# EAGLE design mps340g + mbi270 (1) (EAGLE 9.5.1)
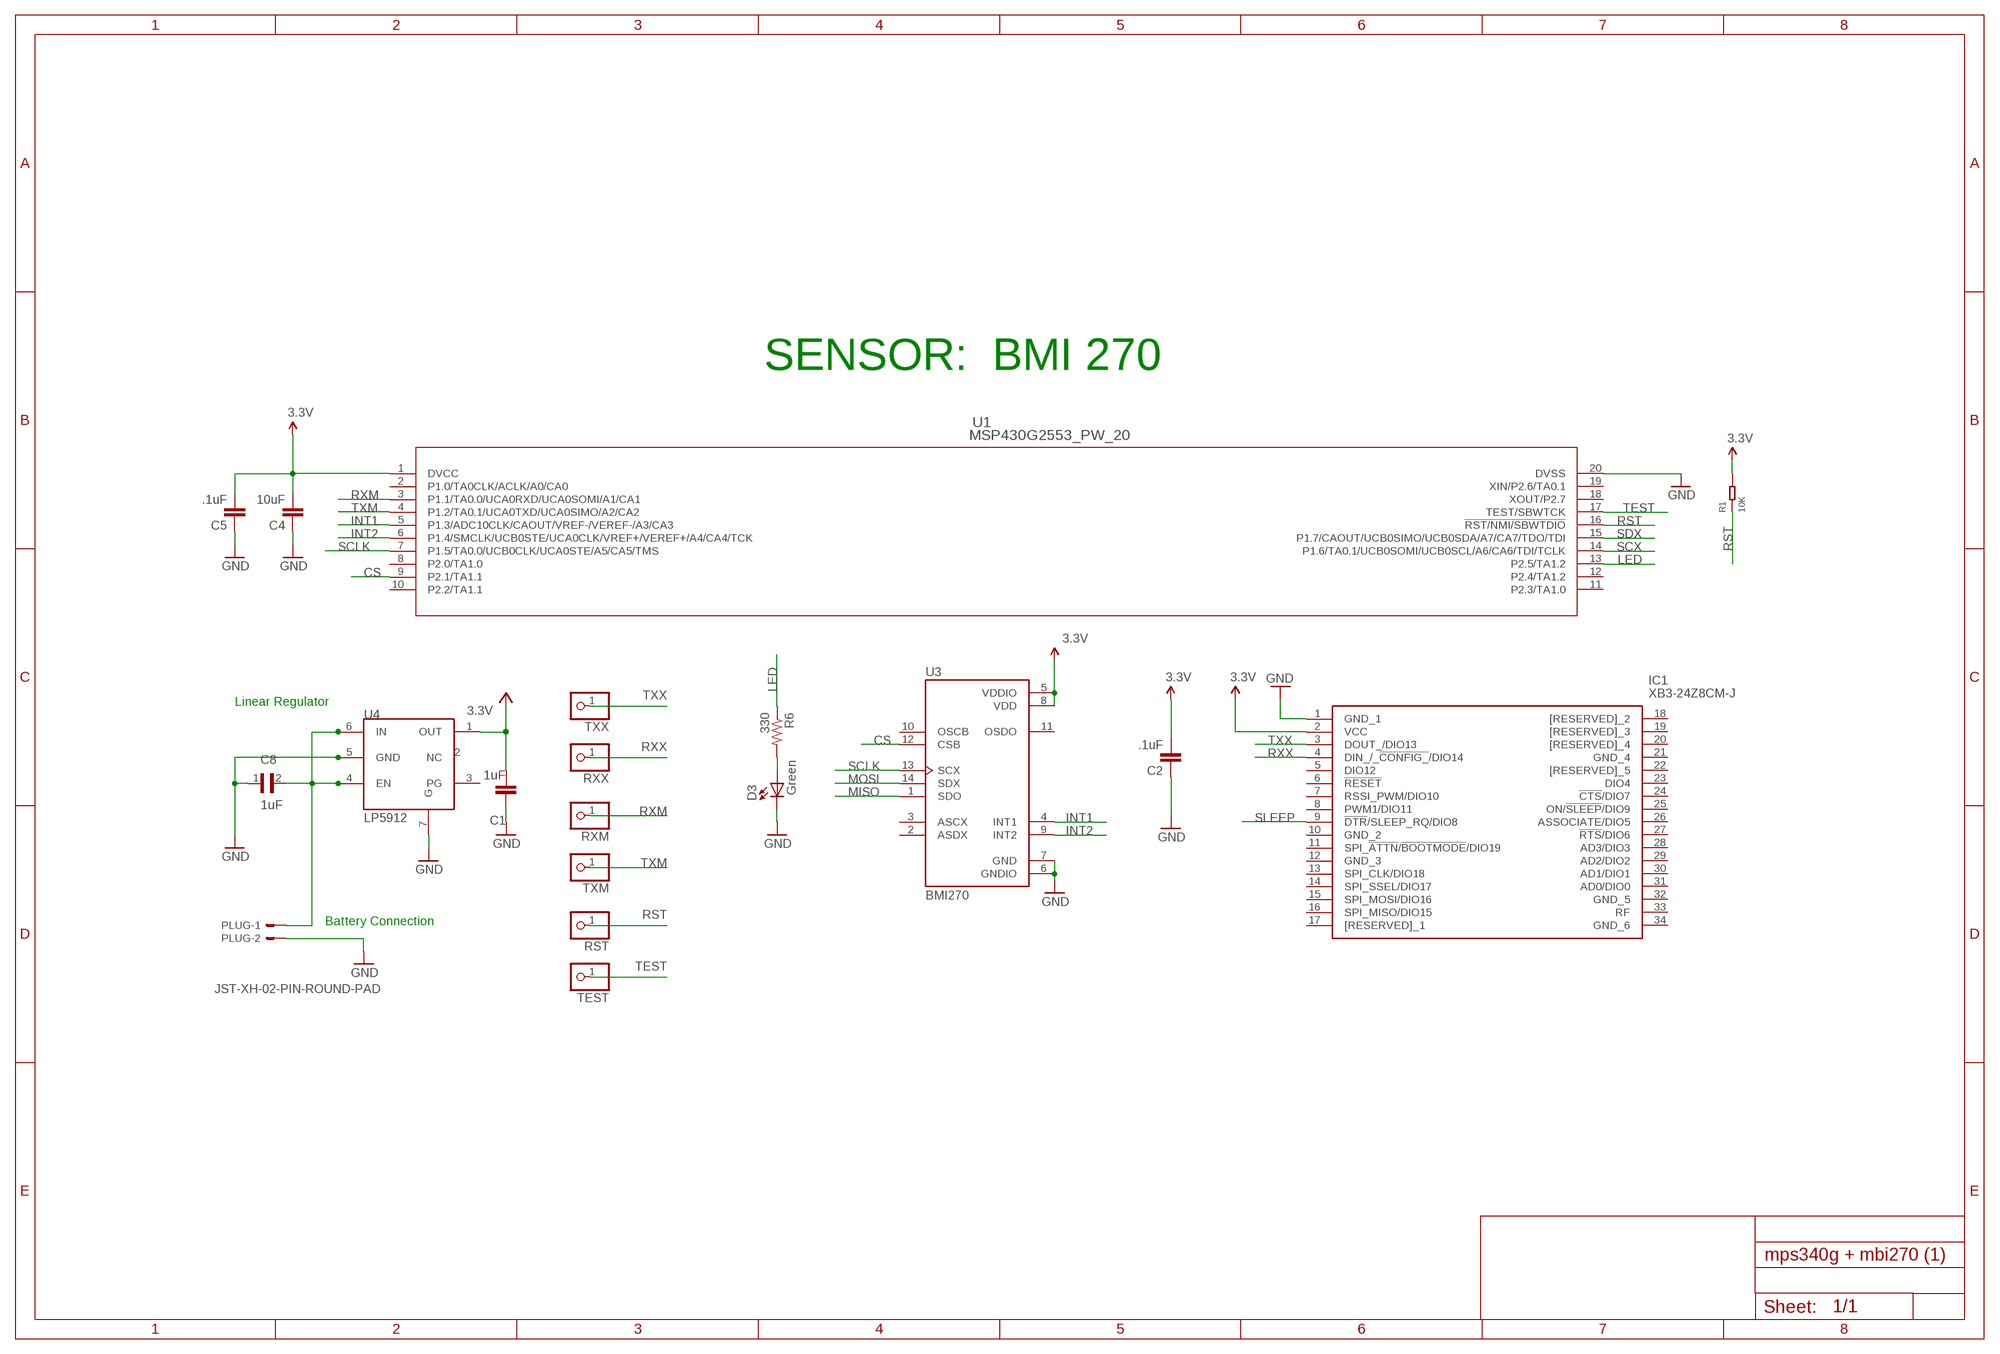
[diagram p0: schematic, sheet 1]

## Parts
C1  1uF  C-EUC0603  [C0603]
C2  .1uF  0.1UF-25V(+80/-20%)(0603)  [0603-CAP]
C4  10uF  0.1UF-25V(+80/-20%)(0603)  [0603-CAP]
C5  .1uF  0.1UF-25V(+80/-20%)(0603)  [0603-CAP]
C8  1uF  0402YD105MAT2A  [CAPC1005X71N]
D3  Green  LED  [0603-LED-ALT1]
IC1  XB3-24Z8CM-J  [XB324Z8CMJ]
PLUG  JST-XH-02-PIN-ROUND-PAD  [JST-XH-02-PACKAGE-ROUND-PAD]
R1  10K  SMD-RES-4.7K-5%-1/16W(0402)  [R0402]
R6  330  RESISTOR0603-RES  [0603-RES]
RST  PINHD-1X1  [1X01]
RXM  PINHD-1X1  [1X01]
RXX  PINHD-1X1  [1X01]
TEST  PINHD-1X1  [1X01]
TXM  PINHD-1X1  [1X01]
TXX  PINHD-1X1  [1X01]
U1  MSP430G2553_PW_20  [PW20]
U3  BMI270  [XDCR_BMI270]
U4  LP5912  [LP5912]

## Nets
3.3V: C2.2 C4.2 C5.2 IC1.2(VCC) R1.2 U1.1(DVCC) U3.5(VDDIO) U3.8(VDD)
BATTERY: C8.2 PLUG.1 U4.4(EN) U4.6(IN)
CS: U1.9(P2.1/TA1.1) U3.12(CSB)
GND [vcc]: C1.1 C2.1 C4.1 C5.1 C8.1 D3.C IC1.1(GND_1) PLUG.2 U1.20(DVSS) U3.6(GNDIO) U3.7(GND) U4.5(GND) U4.7(G)
INT1: U1.5(P1.3/ADC10CLK/CAOUT/VREF-/VEREF-/A3/CA3) U3.4(INT1)
INT2: U1.6(P1.4/SMCLK/UCB0STE/UCA0CLK/VREF+/VEREF+/A4/CA4/TCK) U3.9(INT2)
LED: R6.1 U1.13(P2.5/TA1.2)
MISO: U3.1(SDO)
MOSI: U3.14(SDX)
N$7: D3.A R6.2
RST: R1.1 RST.1 U1.16(!RST/NMI/SBWTDIO)
RXM: RXM.1 U1.3(P1.1/TA0.0/UCA0RXD/UCA0SOMI/A1/CA1)
RXX: IC1.4(DIN_/_!CONFIG_!/DIO14) RXX.1
SCLK: U1.7(P1.5/TA0.0/UCB0CLK/UCA0STE/A5/CA5/TMS) U3.13(SCX)
SCX: U1.14(P1.6/TA0.1/UCB0SOMI/UCB0SCL/A6/CA6/TDI/TCLK)
SDX: U1.15(P1.7/CAOUT/UCB0SIMO/UCB0SDA/A7/CA7/TDO/TDI)
SLEEP: IC1.9(!DTR!/SLEEP_RQ/DIO8)
TEST: TEST.1 U1.17(TEST/SBWTCK)
TXM: TXM.1 U1.4(P1.2/TA0.1/UCA0TXD/UCA0SIMO/A2/CA2)
TXX: IC1.3(DOUT_/DIO13) TXX.1
VCC: C1.2 U4.1(OUT) ; supply symbol labelled 3.3V
Unconnected: IC1.5(DIO12) IC1.6(!RESET) IC1.7(RSSI_PWM/DIO10) IC1.8(PWM1/DIO11) IC1.10(GND_2) IC1.11(SPI_!ATTN!/!BOOTMODE!/DIO19) IC1.12(GND_3) IC1.13(SPI_CLK/DIO18) IC1.14(SPI_SSEL/DIO17) IC1.15(SPI_MOSI/DIO16) IC1.16(SPI_MISO/DIO15) IC1.17([RESERVED]_1) IC1.18([RESERVED]_2) IC1.19([RESERVED]_3) IC1.20([RESERVED]_4) IC1.21(GND_4) IC1.22([RESERVED]_5) IC1.23(DIO4) IC1.24(!CTS!/DIO7) IC1.25(ON/!SLEEP!/DIO9) IC1.26(ASSOCIATE/DIO5) IC1.27(!RTS!/DIO6) IC1.28(AD3/DIO3) IC1.29(AD2/DIO2) IC1.30(AD1/DIO1) IC1.31(AD0/DIO0) IC1.32(GND_5) IC1.33(RF) IC1.34(GND_6) U1.2(P1.0/TA0CLK/ACLK/A0/CA0) U1.8(P2.0/TA1.0) U1.10(P2.2/TA1.1) U1.11(P2.3/TA1.0) U1.12(P2.4/TA1.2) U1.18(XOUT/P2.7) U1.19(XIN/P2.6/TA0.1) U3.2(ASDX) U3.3(ASCX) U3.10(OSCB) U3.11(OSDO) U4.2(NC) U4.3(PG)

## Notes on the sheet
- SENSOR:  BMI 270
- Linear Regulator
- Battery Connection

## Library data of the parts
C1 = rcl:C-EU: CAPACITOR, European symbol; SPICEPREFIX: C
C2 C4 C5 = SparkFun-Capacitors:0.1UF-25V(+80/-20%)(0603): CAP-00810 Ceramic Standard decoupling cap; PROD_ID: CAP-00810; VALUE: 0.1uF
C8 = Capacitor1uF:0402YD105MAT2A: CAP 1UF 16VDC X5R 20% SMD 0402; AVAILABILITY: Unavailable; DESCRIPTION: Cap 1uf 16vdc X5r 20% Smd 0402; MF: AVX; MP: 0402YD105MAT2A; PACKAGE: 1005 AVX; PRICE: None
D3 = Testing:LED: LEDs Standard schematic elements and footprints for 5mm, 3mm, 1206, and 0603 sized LEDs. 5mm - Spark Fun Electronics SKU : COM-00529 (and others)
IC1 = XB3-24Z8CM-J:XB3-24Z8CM-J: Zigbee Modules (802.15.4) XBee3 ,2.4 Ghz ZB 3.0, Chip Ant, MMT Source: Datasheet <https://www.digi.com/resources/documentation/digidocs/pdfs/90001543.pdf>; DESCRIPTION: Zigbee Modules (802.15.4) XBee3 ,2.4 Ghz ZB 3.0, Chip Ant, MMT; HEIGHT: 4mm; MANUFACTURER_NAME: Digi International; MANUFACTURER_PART_NUMBER: XB3-24Z8CM-J; MOUSER_PART_NUMBER: 888-XB3-24Z8CM-J; MOUSER_PRICE-STOCK: https://www.mouser.com/Search/Refine.aspx?Keyword=888-XB3-24Z8CM-J
PLUG = Rembrandt Electronics - JST XH Connectors v1-0:JST-XH-02-PIN: JST XH Connector 2 Pin Wire to board connector. Pitch: 2,54 mm, (0.100") Number of pins: 2 Created by Rembrandt Electronics www.rembrandtelectronics.com
R1 = RES-4.7K-SMD-5_-1_16W_0402_:SMD-RES-4.7K-5%-1/16W(0402): 301010010; AVAILABILITY: Unavailable; DESCRIPTION: Res Thick Film 0402 4.7K Ohm 5% 0.063W_1/16W_ ?100ppm/C Molded SMD Paper T/R; MF: Yageo; MP: RC0402JR074K7L; PACKAGE: 0402 Yageo; PRICE: None
R6 = SparkFun:RESISTOR: Resistor Basic schematic elements and footprints for 0603, 1206, and PTH resistors.
RST RXM RXX TEST TXM TXX = pinhead:PINHD-1X1: PIN HEADER
U1 = MSP430G2553_PW_20:MSP430G2553_PW_20; BUILT_BY: EMA_UL_Team; MANUFACTURER: Texas Instruments; MANUFACTURER_PART_NUMBER: MSP430G2553_PW_20; VENDOR: Texas Instruments
U3 = BMI270:BMI270: IMU ACCEL/GYRO I2C/SPI 14LGA; AVAILABILITY: Unavailable; DESCRIPTION: Accelerometer, Gyroscope, 6 Axis Sensor I²C, SPI Output; MF: Bosch Sensortec; MP: BMI270; PACKAGE: LGA-14 Bosch Sensortec; PRICE: None
U4 = electronic-labs:LP5912

## Net classes
0 default: width 0.203 mm
1 vcc: width 0.254 mm

## Board
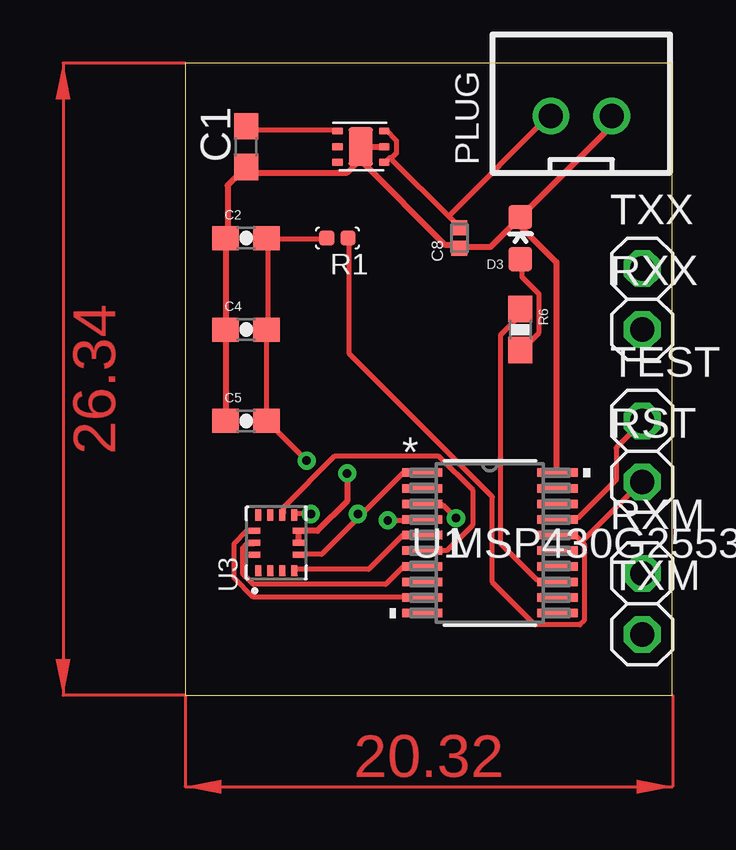
[diagram p1: board, top side]
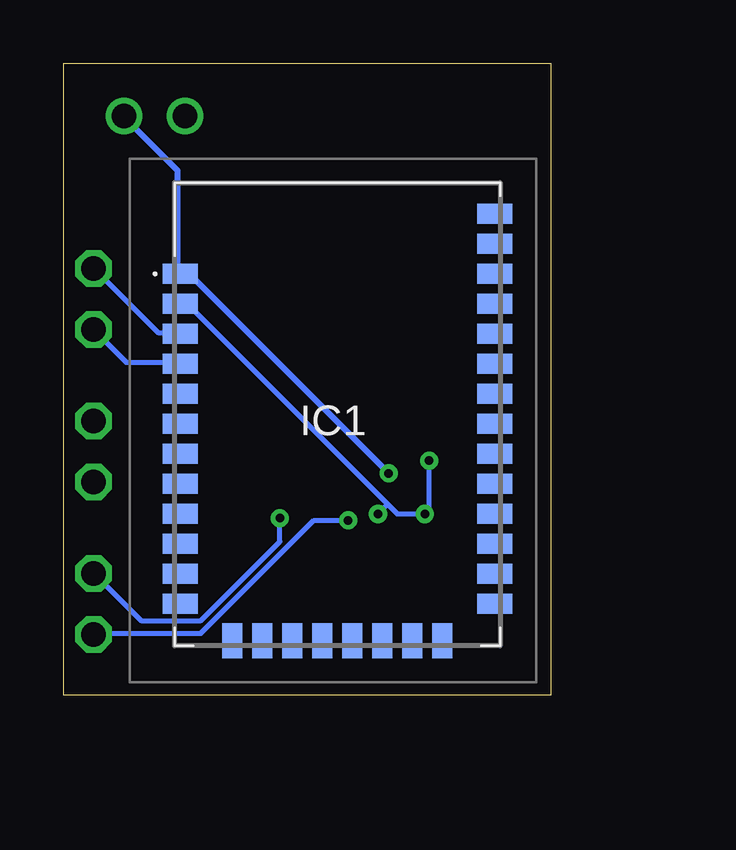
[diagram p2: board, bottom side, seen from below]

Size 20.3 x 26.34 mm. Coordinates in mm from the lower left corner, seen from the top.
Outline: 0,0 20.3,0 20.3,26.34 0,26.34 0,0
Copper layers (1*16): Top 0.035mm / dielectric 1.5mm / Bottom 0.035mm
Design rules "default": minimum track width 6mil, minimum drill 0.35mm, track to track 6mil, track to pad 6mil, pad to pad 6mil, via to via 6mil, smd to smd 6mil, copper to edge 40mil, drill to drill 6mil, minimum pad ring 10mil, minimum via ring 8mil, stop-mask expansion 4mil, vias tented up to drill 0mil, thermal gap 10mil

### Footprints (pad centres in the part's own frame; a part is rotated, then mirrored left to right if it is on the bottom)
C0603 = smd 1.1 x 1: 1 -0.85,0; 2 0.85,0
0603-CAP = smd 1.1 x 1: 1 -0.85,0; 2 0.85,0
CAPC1005X71N = smd 0.62 x 0.67: 1 -0.425,0; 2 0.425,0
0603-LED-ALT1 = smd 1 x 1: A 0,-0.877; C 0,0.877
XB324Z8CMJ = smd 1.448 x 0.838: 1 -6.553,13.75; 2 -6.553,12.5; 3 -6.553,11.25; 4 -6.553,10; 5 -6.553,8.75; 6 -6.553,7.5; 7 -6.553,6.25; 8 -6.553,5; 9 -6.553,3.75; 10 -6.553,2.5; 11 -6.553,1.25; 12 -6.553,0; 21 6.553,0; 22 6.553,1.25; 23 6.553,2.5; 24 6.553,3.75; 25 6.553,5; 26 6.553,6.25; 27 6.553,7.5; 28 6.553,8.75; 29 6.553,10; 30 6.553,11.25; 31 6.553,12.5; 32 6.553,13.75; 33 6.553,15; 34 6.553,16.25 | smd 0.838 x 1.448: 13 -4.375,-1.537; 14 -3.125,-1.537; 15 -1.875,-1.537; 16 -0.625,-1.537; 17 0.625,-1.537; 18 1.875,-1.537; 19 3.125,-1.537; 20 4.375,-1.537
JST-XH-02-PACKAGE-ROUND-PAD = drill 1.016: 1 -1.27,0; 2 1.27,0
R0402 = smd 0.635 x 0.635: 1 0,0.445; 2 0,-0.445
0603-RES = smd 1.1 x 1: 1 -0.85,0; 2 0.85,0
1X01 = drill 1.016 octagon: 1 0,0
PW20 = smd 1.676 x 0.356: 1 -2.819,2.925; 2 -2.819,2.275; 3 -2.819,1.625; 4 -2.819,0.975; 5 -2.819,0.325; 6 -2.819,-0.325; 7 -2.819,-0.975; 8 -2.819,-1.625; 9 -2.819,-2.275; 10 -2.819,-2.925; 11 2.819,-2.925; 12 2.819,-2.275; 13 2.819,-1.625; 14 2.819,-0.975; 15 2.819,-0.325; 16 2.819,0.325; 17 2.819,0.975; 18 2.819,1.625; 19 2.819,2.275; 20 2.819,2.925
XDCR_BMI270 = smd 0.475 x 0.25: 1 -1.163,0.75; 2 -1.163,0.25; 3 -1.163,-0.25; 4 -1.163,-0.75; 8 1.163,-0.75; 9 1.163,-0.25; 10 1.163,0.25; 11 1.163,0.75 | smd 0.25 x 0.475: 5 -0.5,-0.912; 6 0,-0.912; 7 0.5,-0.912; 12 0.5,0.912; 13 0,0.912; 14 -0.5,0.912
LP5912 = smd 0.45 x 0.3: 1 0,0.65; 2 0,0; 3 0,-0.65; 4 1.95,-0.65; 5 1.95,0; 6 1.95,0.65 | smd 1 x 1.6: 7 0.975,0

### Placement (x,y rotation side)
C1  2.54,22.86 90 top
C2  2.54,19.05 0 top
C4  2.54,15.24 0 top
C5  2.54,11.43 0 top
C8  11.43,19.05 90 top
D3  13.97,19.05 0 top
IC1  8.89,3.81 0 bottom
PLUG  16.51,24.13 0 top
R1  6.35,19.05 270 top
R6  13.97,15.24 270 top
RST  19.05,8.89 0 top
RXM  19.05,5.08 0 top
RXX  19.05,15.24 0 top
TEST  19.05,11.43 0 top
TXM  19.05,2.54 0 top
TXX  19.05,17.78 0 top
U1  12.7,6.35 0 top
U3  3.81,6.35 90 top
U4  6.35,22.86 0 top

### Tracks (layer width: path | path; a pad name or v marks a point on that pad's centre or on a via)
3.3V  (via drill 0.35)
  Top 0.203: R1.2 5.87,19.02 3.47,19.02 C2.2 3.47,18.94 3.47,15.29 C4.2 3.38,15.2 3.38,11.47 C5.2 3.47,11.38 v5.07,9.78 | 7.33,7.51 9.07,9.25 9.87,9.25 U1.1 | 7.33,7.51 5.69,5.87 4.8,5.87 U3.5 | v5.25,7.56 4.62,7.56 U3.8 | v7.2,7.56 7.29,7.56 7.33,7.51
  Bottom 0.203: 6.8,7.96 15.11,16.27 15.38,16.27 IC1.2 | 6.8,7.96 6.4,7.56 v5.25,7.56 5.25,7.64 5.07,7.82 v5.07,9.78 | 6.8,7.96 v7.2,7.56
BATTERY
  Top 0.203: 8.62,22.4 8.53,22.4 8.36,22.23 U4.4 | 8.62,22.4 8.8,22.58 8.8,23.11 8.36,23.56 U4.6 | 10.98,19.96 8.62,22.31 8.62,22.4 | 10.98,19.96 11.38,19.56 C8.2 | 10.98,19.96 15.2,24.18 PLUG.1
CS
  Top 0.203: U3.12 2.85,6.84 2.58,6.84 2.04,6.31 2.04,4.89 2.85,4.09 9.87,4.09 U1.9
GND  (via drill 0.35)
  Top 0.254: U3.6 4.71,6.4 U3.7 4.8,6.84 5.51,6.84 6.76,8.09 v6.76,9.25 | C5.1 1.69,11.47 1.69,15.2 C4.1 1.69,15.29 1.69,18.94 C2.1 1.78,19.11 1.78,21.25 2.49,21.96 C1.1 2.67,21.96 2.85,21.78 6.76,21.78 7.29,22.31 7.29,22.76 U4.7 | U4.5 8.27,22.85 7.38,22.85 U4.7 | D3.C 13.96,19.91 12.71,18.67 11.47,18.67 C8.1 11.38,18.76 10.85,18.76 7.38,22.23 U4.7 | U1.20 15.47,9.34 15.47,18.05 13.87,19.65 D3.C | PLUG.2 17.78,23.74 14.05,20 D3.C
  Bottom 0.254: v6.76,9.25 15.02,17.51 15.38,17.51 IC1.1 15.56,17.6 15.56,21.87 17.78,24.09 PLUG.2
INT1
  Top 0.203: U3.4 4.62,5.25 7.64,5.25 9.07,6.67 9.87,6.67 U1.5
INT2
  Top 0.203: U3.9 4.09,7.56 4.09,7.82 6.22,9.96 10.58,9.96 12,8.53 12,7.11 10.94,6.04 9.96,6.04 U1.6
LED
  Top 0.203: R6.1 13.96,16 13.96,15.82 13.16,15.02 13.16,6.31 14.67,4.8 15.47,4.8 U1.13
N$7
  Top 0.203: D3.A 14.05,18.14 14.05,17.42 14.76,16.71 14.76,15.11 14.05,14.4 R6.2
RST
  Top 0.203: 16.54,6.4 16.27,6.67 15.56,6.67 U1.16 | 16.54,6.4 16.62,6.31 16.62,3.11 16.45,2.93 14.58,2.93 12.8,4.71 12.8,8.27 6.84,14.22 6.84,19.02 R1.1 | 16.54,6.4 19.02,8.89 RST.1
RXM  (via drill 0.35)
  Top 0.203: v11.29,7.38 10.76,7.91 9.96,7.91 U1.3
  Bottom 0.203: v11.29,7.38 11.29,6.4 14.58,3.11 17.07,3.11 19.02,5.07 RXM.1
RXX
  Bottom 0.203: IC1.4 15.47,13.87 17.69,13.87 19.02,15.2 RXX.1
SCLK
  Top 0.203: U3.13 2.85,6.31 2.58,6.31 2.4,6.13 2.4,5.07 2.85,4.62 8.36,4.62 9.07,5.33 9.87,5.33 U1.7
TEST
  Top 0.203: U1.17 15.56,7.38 16.36,7.38 17.96,8.98 17.96,10.31 19.02,11.38 TEST.1
TXM  (via drill 0.35)
  Top 0.203: v8.45,7.29 9.87,7.29 U1.4
  Bottom 0.203: v8.45,7.29 9.87,7.29 14.58,2.58 19.02,2.58 TXM.1
TXX
  Bottom 0.203: IC1.3 15.47,15.11 16.36,15.11 19.02,17.78 TXX.1
VCC
  Top 0.203: U4.1 6.31,23.56 2.67,23.56 2.58,23.65 C1.2
(copper drawn outside any net)
  shapes: Top area x2